# Altium schematic sheet airbrakeController_SENSORS.SchDoc
size B
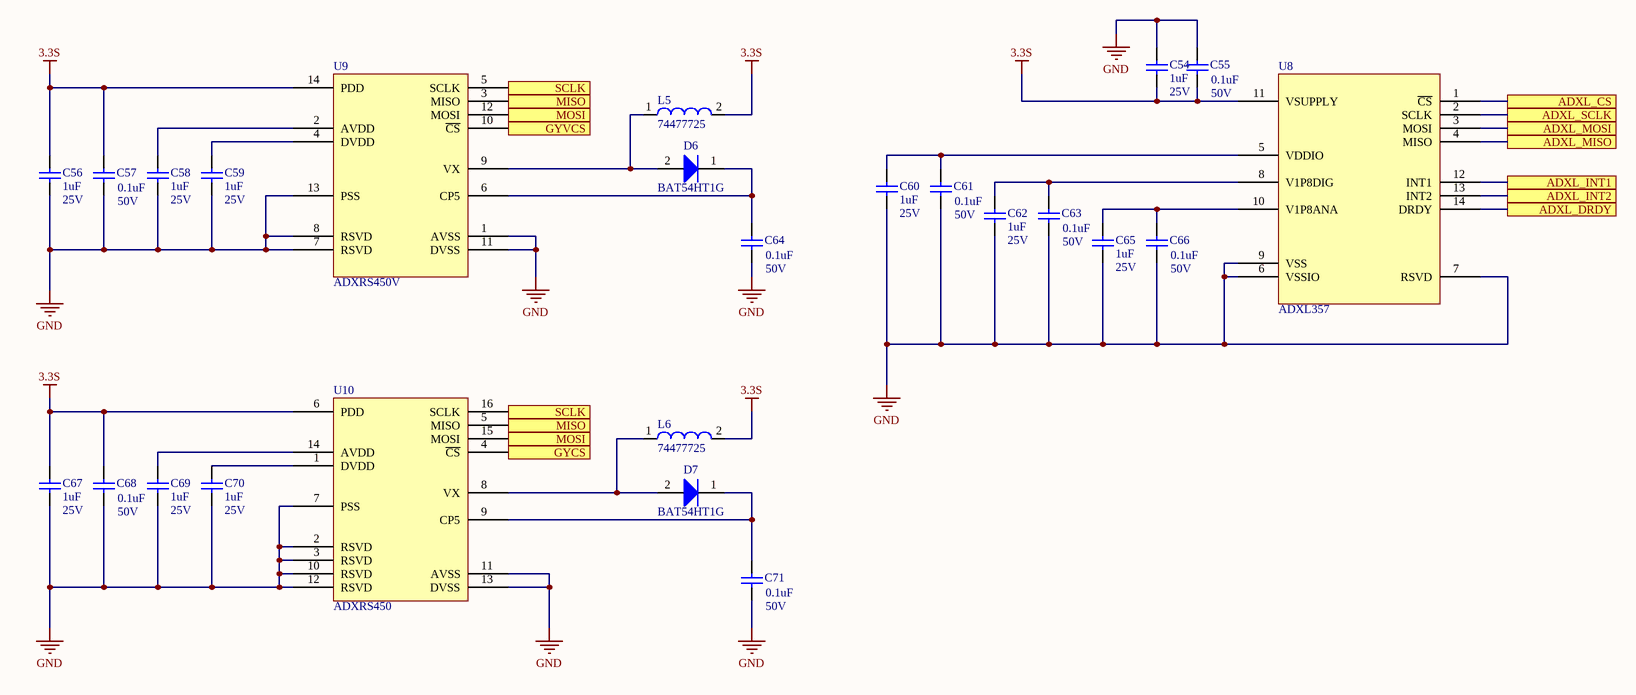
[diagram p0: airbrakeController_SENSORS.SchDoc]

## Parts
C54  Capacitance: 1uF  Voltage Rating: 25V  [CAPC2013X140X50LL20T25]  (hidden comment: C0805C105K3RACTU)
C55  Voltage Rating: 50V  Capacitance: 0.1uF  [CAPC2013X95X50ML10T25]  (hidden comment: CC0805KRX7R9BB104)
C56  Capacitance: 1uF  Voltage Rating: 25V  [CAPC2013X140X50LL20T25]  (hidden comment: C0805C105K3RACTU)
C57  Voltage Rating: 50V  Capacitance: 0.1uF  [CAPC2013X95X50ML10T25]  (hidden comment: CC0805KRX7R9BB104)
C58  Capacitance: 1uF  Voltage Rating: 25V  [CAPC2013X140X50LL20T25]  (hidden comment: C0805C105K3RACTU)
C59  Capacitance: 1uF  Voltage Rating: 25V  [CAPC2013X140X50LL20T25]  (hidden comment: C0805C105K3RACTU)
C60  Capacitance: 1uF  Voltage Rating: 25V  [CAPC2013X140X50LL20T25]  (hidden comment: C0805C105K3RACTU)
C61  Voltage Rating: 50V  Capacitance: 0.1uF  [CAPC2013X95X50ML10T25]  (hidden comment: CC0805KRX7R9BB104)
C62  Capacitance: 1uF  Voltage Rating: 25V  [CAPC2013X140X50LL20T25]  (hidden comment: C0805C105K3RACTU)
C63  Voltage Rating: 50V  Capacitance: 0.1uF  [CAPC2013X95X50ML10T25]  (hidden comment: CC0805KRX7R9BB104)
C64  Voltage Rating: 50V  Capacitance: 0.1uF  [CAPC2013X95X50ML10T25]  (hidden comment: CC0805KRX7R9BB104)
C65  Capacitance: 1uF  Voltage Rating: 25V  [CAPC2013X140X50LL20T25]  (hidden comment: C0805C105K3RACTU)
C66  Voltage Rating: 50V  Capacitance: 0.1uF  [CAPC2013X95X50ML10T25]  (hidden comment: CC0805KRX7R9BB104)
C67  Capacitance: 1uF  Voltage Rating: 25V  [CAPC2013X140X50LL20T25]  (hidden comment: C0805C105K3RACTU)
C68  Voltage Rating: 50V  Capacitance: 0.1uF  [CAPC2013X95X50ML10T25]  (hidden comment: CC0805KRX7R9BB104)
C69  Capacitance: 1uF  Voltage Rating: 25V  [CAPC2013X140X50LL20T25]  (hidden comment: C0805C105K3RACTU)
C70  Capacitance: 1uF  Voltage Rating: 25V  [CAPC2013X140X50LL20T25]  (hidden comment: C0805C105K3RACTU)
C71  Voltage Rating: 50V  Capacitance: 0.1uF  [CAPC2013X95X50ML10T25]  (hidden comment: CC0805KRX7R9BB104)
D6  BAT54HT1G  [ONSC-SOD-323-2-477-02_V]
D7  BAT54HT1G  [ONSC-SOD-323-2-477-02_V]
L5  74477725  [WE-PD-M]
L6  74477725  [WE-PD-M]
U8  ADXL357  [LCCS127P605X560X220-14N]
U9  ADXRS450V  [LCC127P900X400X915-14N]
U10  ADXRS450  [SOIC127P1040X373-16N]

## Ports
ADXL_CS, ADXL_DRDY, ADXL_INT1, ADXL_INT2, ADXL_MISO, ADXL_MOSI, ADXL_SCLK, GYCS, GYVCS, MISO, MOSI, SCLK

## Nets
3.3S: C54.2 C55.2 C56.1 C57.1 C67.1 C68.1 L5.2 L6.2 U8.11(VSUPPLY) U9.14(PDD) U10.6(PDD)
GND: C54.1 C55.1 C56.2 C57.2 C58.2 C59.2 C60.2 C61.2 C62.2 C63.2 C64.2 C65.2 C66.2 C67.2 C68.2 C69.2 C70.2 C71.2 U8.6(VSSIO) U8.7(RSVD) U8.9(VSS) U9.1(AVSS) U9.7(RSVD) U9.8(RSVD) U9.11(DVSS) U9.13(PSS) U10.2(RSVD) U10.3(RSVD) U10.7(PSS) U10.10(RSVD) U10.11(AVSS) U10.12(RSVD) U10.13(DVSS)
ADXL_CS: U8.1(~{CS}) ; port ADXL_CS
ADXL_DRDY: U8.14(DRDY) ; port ADXL_DRDY
ADXL_INT1: U8.12(INT1) ; port ADXL_INT1
ADXL_INT2: U8.13(INT2) ; port ADXL_INT2
ADXL_MISO: U8.4(MISO) ; port ADXL_MISO
ADXL_MOSI: U8.3(MOSI) ; port ADXL_MOSI
ADXL_SCLK: U8.2(SCLK) ; port ADXL_SCLK
GYCS: U10.4(~{CS}) ; port GYCS
GYVCS: U9.10(~{CS}) ; port GYVCS
MISO: U9.3(MISO) U10.5(MISO) ; port MISO
MOSI: U9.12(MOSI) U10.15(MOSI) ; port MOSI
SCLK: U9.5(SCLK) U10.16(SCLK) ; port SCLK
NetC58_1: C58.1 U9.2(AVDD)
NetC59_1: C59.1 U9.4(DVDD)
NetC60_1: C60.1 C61.1 U8.5(VDDIO)
NetC62_1: C62.1 C63.1 U8.8(V1P8DIG)
NetC64_1: C64.1 D6.1(K) U9.6(CP5)
NetC65_1: C65.1 C66.1 U8.10(V1P8ANA)
NetC69_1: C69.1 U10.14(AVDD)
NetC70_1: C70.1 U10.1(DVDD)
NetC71_1: C71.1 D7.1(K) U10.9(CP5)
NetD6_2: D6.2(A) L5.1 U9.9(VX)
NetD7_2: D7.2(A) L6.1 U10.8(VX)

## Library data of the parts
C54 C56 C58-C60 C62 C65 C67 C69 C70 = CMP-2007-03234-1: Manufacturer: Kemet; Part Number: C0805C105K3RACTU
C55 C57 C61 C63 C64 C66 C68 C71 = CMP-2100-03606-1: Chip Capacitor, 100 nF, +/- 10%, 50 V, -55 to 125 degC, 0805 (2012 Metric), RoHS, Tape and Reel; Manufacturer: Yageo; Dielectric: X7R; Insulation Resistance: 100GR; Material: Ceramic; Tolerance: 10%; RoHSCompliant: True; Case Code (Metric): 2012; Length: 2mm; Lead Free: LeadFree; Radiation Hardening: No; Min Operating Temperature: -55degC; Max Operating Temperature: 125degC; Voltage: 50V; Termination: SMD/SMT; Thickness: 0.033inch; Package Description: 2-Pin Surface Mount Device, Body 2 x 1.25 mm; Depth: 1.25mm; Packaging: TapeandReel; Datasheet Version: Rev. 15, 10/2016; Height: 0.85mm; Package Reference: 0805; Manufacturer URL: http://www.yageo.com/; Case/Package: 0805; Case Code (Imperial): 0805; Datasheet URL: http://www.yageo.com/documents/recent/UPY-GPHC_X7R_6.3V-to-50V_15.pdf; Mount: SurfaceMount; REACH SVHC: NoSVHC; Package Quantity: 1; Number of Pins: 2; Width: 0.049inch
D6 D7 = CMP-1055-00462-1: Schottky Barrier Diode, 2-Pin SOD-323, Pb-Free, Tape and Reel; Manufacturer: On Semiconductor; Configuration: Single; trr Max (ns): 5; IFSM Max (A): 0.6; ComponentLink3URL: http://www.onsemi.com/pub_link/Collateral/477-02.PDF.1; PackageDescription: 2-Pin SOD, Body 1.7 x 1.25 mm; ComponentLink2URL: http://www.onsemi.cn/pub_link/Collateral/BAT54HT1-D.PDF; ComponentLink3Description: Package Specification; ComponentLink2Description: Datasheet; DatasheetVersion: Rev. 6; PackageReference: SOD-323-2-477-02; RoHS: TRUE; ComponentLink1URL: http://www.onsemi.com/; Packing: Tape and Reel; PartNumber: BAT54HT1G; Mounting Technology: Surface Mount; ComponentLink1Description: Manufacturer URL; PackageVersion: Rev. H, 03/2007
L5 L6 = CMP-0227-00119-1: SMD-Shielded Power Inductor WE-PD, L = 560 µH; Inductance: 560 ÂµH; ComponentLink1Description: Manufacturer Link; PackageReference: WE-PD-M; PackageVersion: 2006; ComponentLink2URL: http://www.we-online.de/katalog/media/pdf/74477725.pdf; PackageDescription: SMD Inductor, 2-Leads, Body 7.3 x 7.3 mm; ComponentLink2Description: Datasheet; ComponentLink1URL: http://www.we-online.com; DatasheetVersion: ver 2, Oct-2004